# EAGLE design Nano Leonardo no 3V3 (EAGLE 6.2)
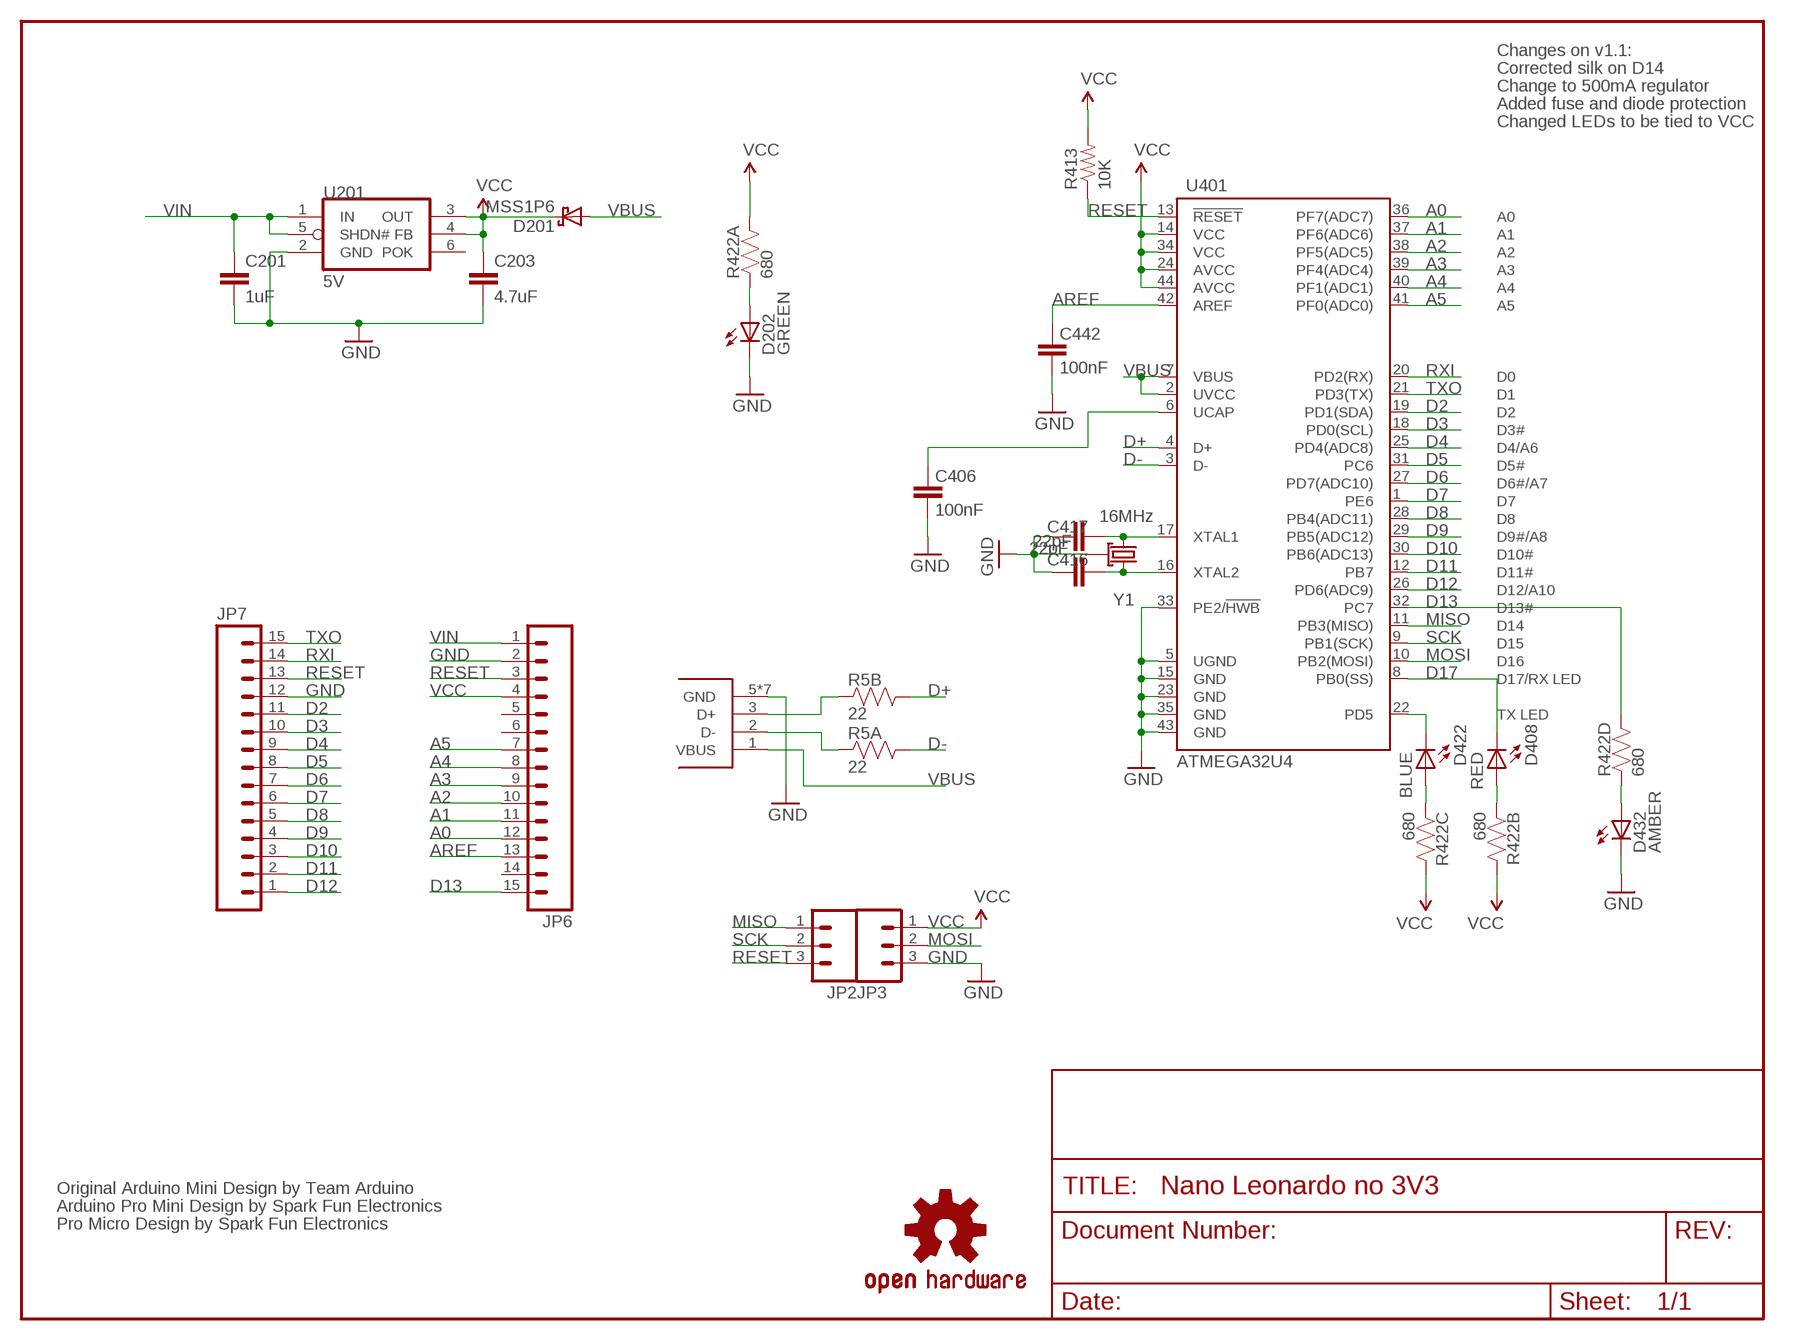
[diagram p0: schematic, sheet 1]

## Parts
C201  1uF  CAP0402-CAP  [0402-CAP]
C203  4.7uF  CAP0402-CAP  [0402-CAP]
C406  100nF  CAP0402-CAP  [0402-CAP]
C416  22pF  CAP0402-CAP  [0402-CAP]
C417  22pF  CAP0402-CAP  [0402-CAP]
C442  100nF  CAP0402-CAP  [0402-CAP]
D201  MSS1P6  [MICROSMP]
D202  GREEN  LED0603  [LED-0603]
D408  RED  LED0603  [LED-0603]
D422  BLUE  LED0603  [LED-0603]
D432  AMBER  LED0603  [LED-0603]
JP2  M031X03_NO_SILK  [1X03_NO_SILK]
JP3  M031X03_NO_SILK  [1X03_NO_SILK]
JP6  M15  [1X15]
JP7  M15  [1X15]
R5  22  RP2EXB24V  [CRA02]
R413  10K  RESISTOR0402-RES  [0402-RES]
R422  680  RP404  [CRA04]
U201  5V  MAX8881  [SOT-23-6]
U401  ATMEGA32U4  ATMEGA32U4QFN2  [QFN-44-NOPAD]
U$3  OSHW-LOGOS  [OSHW-LOGO-S]
X1  USB_MICROB_JSTGCT  [USB_MICROB_3075]
Y1  16MHz  CX2520  [CRYSTAL_SMD_2MM_2_5MM]

## Nets
A0: JP6.12 U401.36(PF7(ADC7))
A1: JP6.11 U401.37(PF6(ADC6))
A2: JP6.10 U401.38(PF5(ADC5))
A3: JP6.9 U401.39(PF4(ADC4))
A4: JP6.8 U401.40(PF1(ADC1))
A5: JP6.7 U401.41(PF0(ADC0))
AREF: C442.2 JP6.13 U401.42(AREF)
D2: JP7.11 U401.19(PD1(SDA))
D3: JP7.10 U401.18(PD0(SCL))
D4: JP7.9 U401.25(PD4(ADC8))
D5: JP7.8 U401.31(PC6)
D6: JP7.7 U401.27(PD7(ADC10))
D7: JP7.6 U401.1(PE6)
D8: JP7.5 U401.28(PB4(ADC11))
D9: JP7.4 U401.29(PB5(ADC12))
D10: JP7.3 U401.30(PB6(ADC13))
D11: JP7.2 U401.12(PB7)
D12: JP7.1 U401.26(PD6(ADC9))
D13: JP6.15 R422.5 U401.32(PC7)
D17: D408.C U401.8(PB0(SS))
D+: R5.3 U401.4(D+)
D-: R5.4 U401.3(D-)
GND [vcc]: C201.2 C203.2 C406.1 C416.2 C417.2 C442.1 D202.C D432.C JP3.3 JP6.2 JP7.12 U201.2(GND) U401.5(UGND) U401.15(GND) U401.23(GND) U401.33(PE2/!HWB) U401.35(GND) U401.43(GND) X1.5(GND) X1.P$1(GND) X1.P$2(GND) X1.P$3(GND) X1.P$4(GND) X1.P$8(GND) X1.P$10(GND) Y1.2(GND) Y1.4(GND)
MISO: JP2.1 U401.11(PB3(MISO))
MOSI: JP3.2 U401.10(PB2(MOSI))
N$1: D422.A R422.3
N$2: D408.A R422.2
N$3: D432.A R422.4
N$4: C406.2 U401.6(UCAP)
N$6: R5.1 X1.2(D-)
N$8: R5.2 X1.3(D+)
N$38: D202.A R422.1
RESET: JP2.3 JP6.3 JP7.13 R413.1 U401.13(!RESET)
RXI: JP7.14 U401.20(PD2(RX))
SCK: JP2.2 U401.9(PB1(SCK))
TXLED: D422.C U401.22(PD5)
TXO: JP7.15 U401.21(PD3(TX))
VBUS: D201.A U401.2(UVCC) U401.7(VBUS) X1.1(VBUS)
VCC: C203.1 D201.K JP3.1 JP6.4 R413.2 R422.6 R422.7 R422.8 U201.3(OUT) U201.4(FB) U401.14(VCC) U401.24(AVCC) U401.34(VCC) U401.44(AVCC)
VIN: C201.1 JP6.1 U201.1(IN) U201.5(SHDN#)
XTAL1: C417.1 U401.17(XTAL1) Y1.1
XTAL2: C416.1 U401.16(XTAL2) Y1.3
Unconnected: JP6.5 JP6.6 JP6.14 U201.6(POK)

## Notes on the sheet
- Changes on v1.1:
- Corrected silk on D14
- Change to 500mA regulator
- Added fuse and diode protection
- Changed LEDs to be tied to VCC
- Original Arduino Mini Design by Team Arduino
- Arduino Pro Mini Design by Spark Fun Electronics
- Pro Micro Design by Spark Fun Electronics

## Library data of the parts
C201 = SparkFun:CAP: Capacitor Standard 0603 ceramic capacitor, and 0.1" leaded capacitor.; DIGIKEY: 445-1415-1-ND
C203 = SparkFun:CAP: Capacitor Standard 0603 ceramic capacitor, and 0.1" leaded capacitor.; DIGIKEY: 445-7395-1-ND
C406 C416 C417 C442 = SparkFun:CAP: Capacitor Standard 0603 ceramic capacitor, and 0.1" leaded capacitor.
D201 = KwanSystems:MSS1P6; DIGIKEY: MSS1P6-M3/89AGICT-ND
D202 D408 D422 D432 = SparkFun:LED: LEDs Standard schematic elements and footprints for 5mm, 3mm, 1206, and 0603 sized LEDs. 5mm - Spark Fun Electronics SKU : COM-00529 (and others)
JP2 JP3 = SparkFun-Connectors:M03: Header 3 Standard 3-pin 0.1" header. Use with straight break away headers (SKU : PRT-00116), right angle break away headers (PRT-00553), swiss pins (PRT-00743), machine pins (PRT-00117), and female headers (PRT-00115). Molex polarized connector foot print use with SKU : PRT-08232 with associated crimp pins and housings.
JP6 JP7 = SparkFun-Connectors:M15: Header 15 Standard 15-pin 0.1" header. Use with straight break away headers (SKU : PRT-00116), right angle break away headers (PRT-00553), swiss pins (PRT-00743), machine pins (PRT-00117), and female headers (PRT-00115).
R5 = KwanSystems:RP2
R413 = SparkFun:RESISTOR: Resistor Basic schematic elements and footprints for 0603, 1206, and PTH resistors.
R422 = KwanSystems:RP4
U201 = KwanSystems:MAX8881; DIGIKEY: MAX8881EUT50+TCT-ND
U401 = SparkFun:ATMEGA32U4
U$3 = SparkFun:OSHW-LOGO: Open Source Hardware Logo This logo indicates the piece of hardware it is found on incorporates a OSHW license and/or adheres to the definition of open source hardware found here: http://freedomdefined.org/OSHW
X1 = KwanSystems:USB_MICROB_JST
Y1 = KwanSystems:CX2520

## Net classes
0 default: width 0.152 mm, drill 0.33 mm, clearance 0.152 mm

## Board
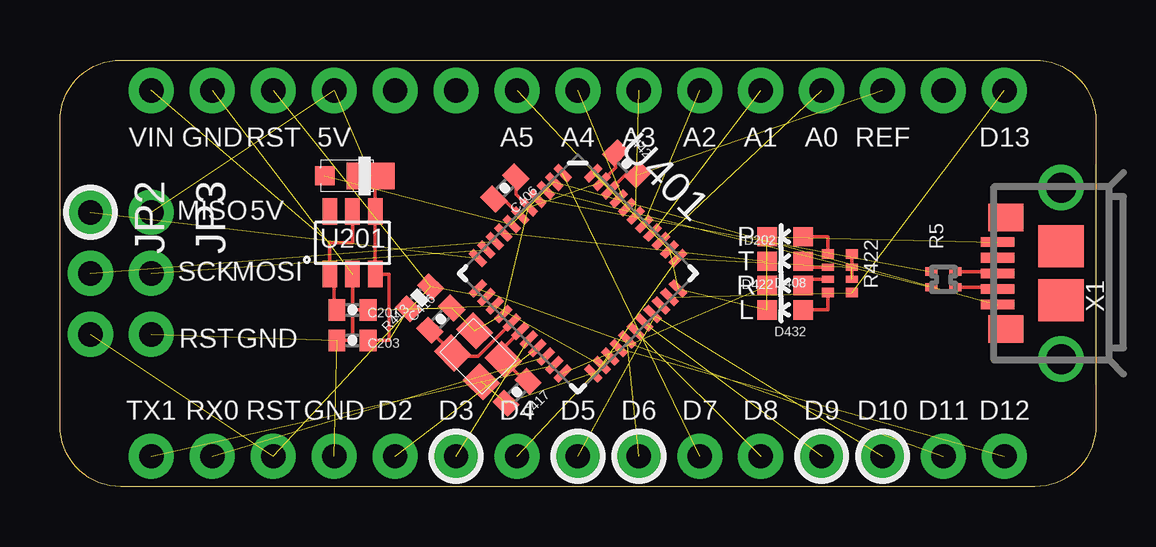
[diagram p1: board, top side]
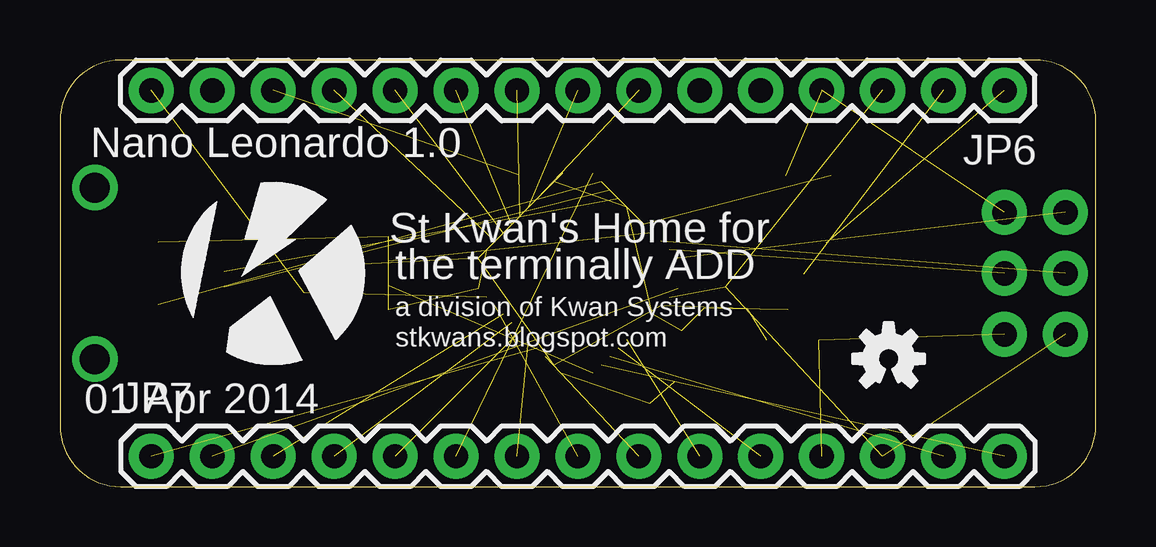
[diagram p2: board, bottom side, seen from below]

Size 43.18 x 17.78 mm. Coordinates in mm from the lower left corner, seen from the top.
Outline: 40.64,0 2.54,0 arc-90 0,2.54 0,15.24 arc-90 2.54,17.78 40.64,17.78 arc-90 43.18,15.24 43.18,2.54 arc-90 40.64,0
Copper layers (1*16): Top 0.0356mm / dielectric 1.5011mm / Bottom 0.0356mm
Design rules: minimum track width 6mil, minimum drill 13mil, track to track 6mil, track to pad 6mil, pad to pad 6mil, via to via 6mil, smd to smd 6mil, copper to edge 15mil, drill to drill 6mil, minimum pad ring 7mil, minimum via ring 7mil, stop-mask expansion 4mil, vias tented up to drill 0mil, thermal gap 10mil

### Footprints (pad centres in the part's own frame; a part is rotated, then mirrored left to right if it is on the bottom)
0402-CAP = smd 0.7 x 0.9: 1 -0.65,0; 2 0.65,0
MICROSMP = smd 0.8 x 0.8: A 0.9,0 | smd 2 x 1.1: K -1,0
LED-0603 = smd 0.8 x 0.8: A 0,-0.75; C 0,0.75
1X03_NO_SILK = drill 1.016 pad 1.88: 1 0,0; 2 2.54,0; 3 5.08,0
1X15 = drill 1.016 pad 1.88: 1 0,0; 2 2.54,0; 3 5.08,0; 4 7.62,0; 5 10.16,0; 6 12.7,0; 7 15.24,0; 8 17.78,0; 9 20.32,0; 10 22.86,0; 11 25.4,0; 12 27.94,0; 13 30.48,0; 14 33.02,0; 15 35.56,0
CRA02 = smd 0.35 x 0.5: 1 -0.325,-0.5; 2 0.325,-0.5; 3 0.325,0.5; 4 -0.325,0.5
0402-RES = smd 0.7 x 0.9: 1 -0.65,0; 2 0.65,0
CRA04 = smd 0.4 x 0.5: 1 -0.8,-0.5; 4 0.8,-0.5; 5 0.8,0.5; 8 -0.8,0.5 | smd 0.3 x 0.5: 2 -0.25,-0.5; 3 0.25,-0.5; 6 0.25,0.5; 7 -0.25,0.5
SOT-23-6 = smd 0.6 x 1.1: 1 -0.95,-1.3; 2 0,-1.3; 3 0.95,-1.3; 4 0.95,1.3; 5 0,1.3; 6 -0.95,1.3
QFN-44-NOPAD = smd 0.8 x 0.3: 1 -3.4,2.5; 2 -3.4,2; 3 -3.4,1.5; 4 -3.4,1; 5 -3.4,0.5; 6 -3.4,0; 7 -3.4,-0.5; 8 -3.4,-1; 9 -3.4,-1.5; 10 -3.4,-2; 11 -3.4,-2.5; 23 3.4,-2.5; 24 3.4,-2; 25 3.4,-1.5; 26 3.4,-1; 27 3.4,-0.5; 28 3.4,0; 29 3.4,0.5; 30 3.4,1; 31 3.4,1.5; 32 3.4,2; 33 3.4,2.5 | smd 0.3 x 0.8: 12 -2.5,-3.4; 13 -2,-3.4; 14 -1.5,-3.4; 15 -1,-3.4; 16 -0.5,-3.4; 17 0,-3.4; 18 0.5,-3.4; 19 1,-3.4; 20 1.5,-3.4; 21 2,-3.4; 22 2.5,-3.4; 34 2.5,3.4; 35 2,3.4; 36 1.5,3.4; 37 1,3.4; 38 0.5,3.4; 39 0,3.4; 40 -0.5,3.4; 41 -1,3.4; 42 -1.5,3.4; 43 -2,3.4; 44 -2.5,3.4
USB_MICROB_3075 = smd 0.4 x 1.4: 1 -1.3,4.1; 2 -0.65,4.1; 3 0,4.1; 4 0.65,4.1; 5 1.3,4.1 | smd 1.15 x 1.45: P$1 2.32,3.75; P$10 -2.32,3.75 | smd 1.75 x 1.9: P$2 1.125,1.45; P$8 -1.125,1.45 | drill 1.25 pad 1.9: P$3 -3.575,1.45; P$4 3.575,1.45
CRYSTAL_SMD_2MM_2_5MM = smd 1.2 x 1: 1 -0.85,-0.65; 2 0.85,-0.65; 3 0.85,0.65; 4 -0.85,0.65

### Placement (x,y rotation side)
C201  12.19,7.37 0 top
C203  12.19,6.1 180 top
C406  18.54,12.45 225 top
C416  15.88,6.99 45 top
C417  19.05,3.94 225 top
C442  23.62,13.46 315 top
D201  11.94,12.95 180 top
D202  30.23,10.41 90 top
D408  30.23,9.4 90 top
D422  30.23,8.38 90 top
D432  30.23,7.37 90 top
JP2  1.27,11.43 270 top
JP3  3.81,11.43 270 top
JP6  3.81,16.51 180 bottom
JP7  39.37,1.27 0 bottom
R5  36.83,8.64 90 top
R413  14.99,7.87 225 top
R422  32.51,8.89 270 top
U201  12.19,10.16 0 top
U401  21.59,8.89 315 top
U$1  [KWAN_CIRCLE]  34.29,8.89 0 bottom
U$3  8.64,5.33 0 bottom
X1  43.18,8.89 90 top
Y1  17.42,5.44 135 top

### Tracks (layer width: path | path; a pad name or v marks a point on that pad's centre or on a via)
A0  (1 unrouted)
A1  (1 unrouted)
A2  (1 unrouted)
A3  (1 unrouted)
A4  (1 unrouted)
A5  (1 unrouted)
AREF  (1 unrouted)
  Top 0.152: C442.2 23.58,13 U401.42
D2  (1 unrouted)
D3  (1 unrouted)
D4  (1 unrouted)
D5  (1 unrouted)
D6  (1 unrouted)
D7  (1 unrouted)
D8  (1 unrouted)
D9  (1 unrouted)
D10  (1 unrouted)
D11  (1 unrouted)
D12  (1 unrouted)
D13  (2 unrouted)
D17  (1 unrouted)
D+  (1 unrouted)
D-  (1 unrouted)
GND  (15 unrouted)
  Top 0.152: C406.1 19,12.19 U401.5 | C442.1 23.16,13.29 U401.43 | U201.2 12.19,7.37 | 12.19,7.37 C201.2 | C203.2 12.19,6.1 12.19,7.37
MISO  (1 unrouted)
MOSI  (1 unrouted)
N$1
  Top 0.152: D422.A 31.23,8.64 R422.3
N$2
  Top 0.152: D408.A 31.23,9.14 R422.2
N$3
  Top 0.152: R422.4 32.01,7.37 D432.A
N$4
  Top 0.152: C406.2 18.49,11.99 U401.6
N$6
  Top 0.152: R5.1 39.08,8.31 X1.2
N$8
  Top 0.152: R5.2 39.08,8.96 X1.3
N$38
  Top 0.152: R422.1 32.01,10.41 D202.A
RESET  (4 unrouted)
RXI  (1 unrouted)
SCK  (1 unrouted)
TXLED  (1 unrouted)
TXO  (1 unrouted)
VBUS  (3 unrouted)
VCC  (9 unrouted)
  Top 0.152: R422.6 R422.8 | D201.K 13.14,12.95 U201.4 U201.3 13.72,8.86 13.72,6.1 C203.1
VIN  (1 unrouted)
  Top 0.152: C201.1 11.43,7.48 11.43,8.86 U201.1 11.24,10.16 12.19,10.16 U201.5
XTAL1
  Top 0.152: U401.17 18.48,5.79 Y1.1 19.38,4.4 C417.1
XTAL2
  Top 0.152: U401.16 17.42,5.44 16.5,5.44 Y1.3 C416.1

### Text on the board
tPlace: VIN | GND | RST | 5V | A5 | A4 | A3 | A2 | A1 | A0 | REF | D13 | MISO | 5V | P | SCK | MOSI | T | R | RST | GND | L | TX1 | RX0 | RST | GND | D2 | D3 | D4 | D5 | D6 | D7 | D8 | D9 | D10 | D11 | D12
bPlace: Nano Leonardo 1.0 | St Kwan's Home for | the terminally ADD | a division of Kwan Systems | stkwans.blogspot.com | 01 Apr 2014
tValues: Valid combinations: | 3.3V Reg / 8MHz | 5V Reg / 16MHz | Mark back accordingly